# Altium schematic sheet УШЯИ687253.017Э3_2.SchDoc
size 420 x 297 mm; SheetNumber: 2; SheetTotal: 3
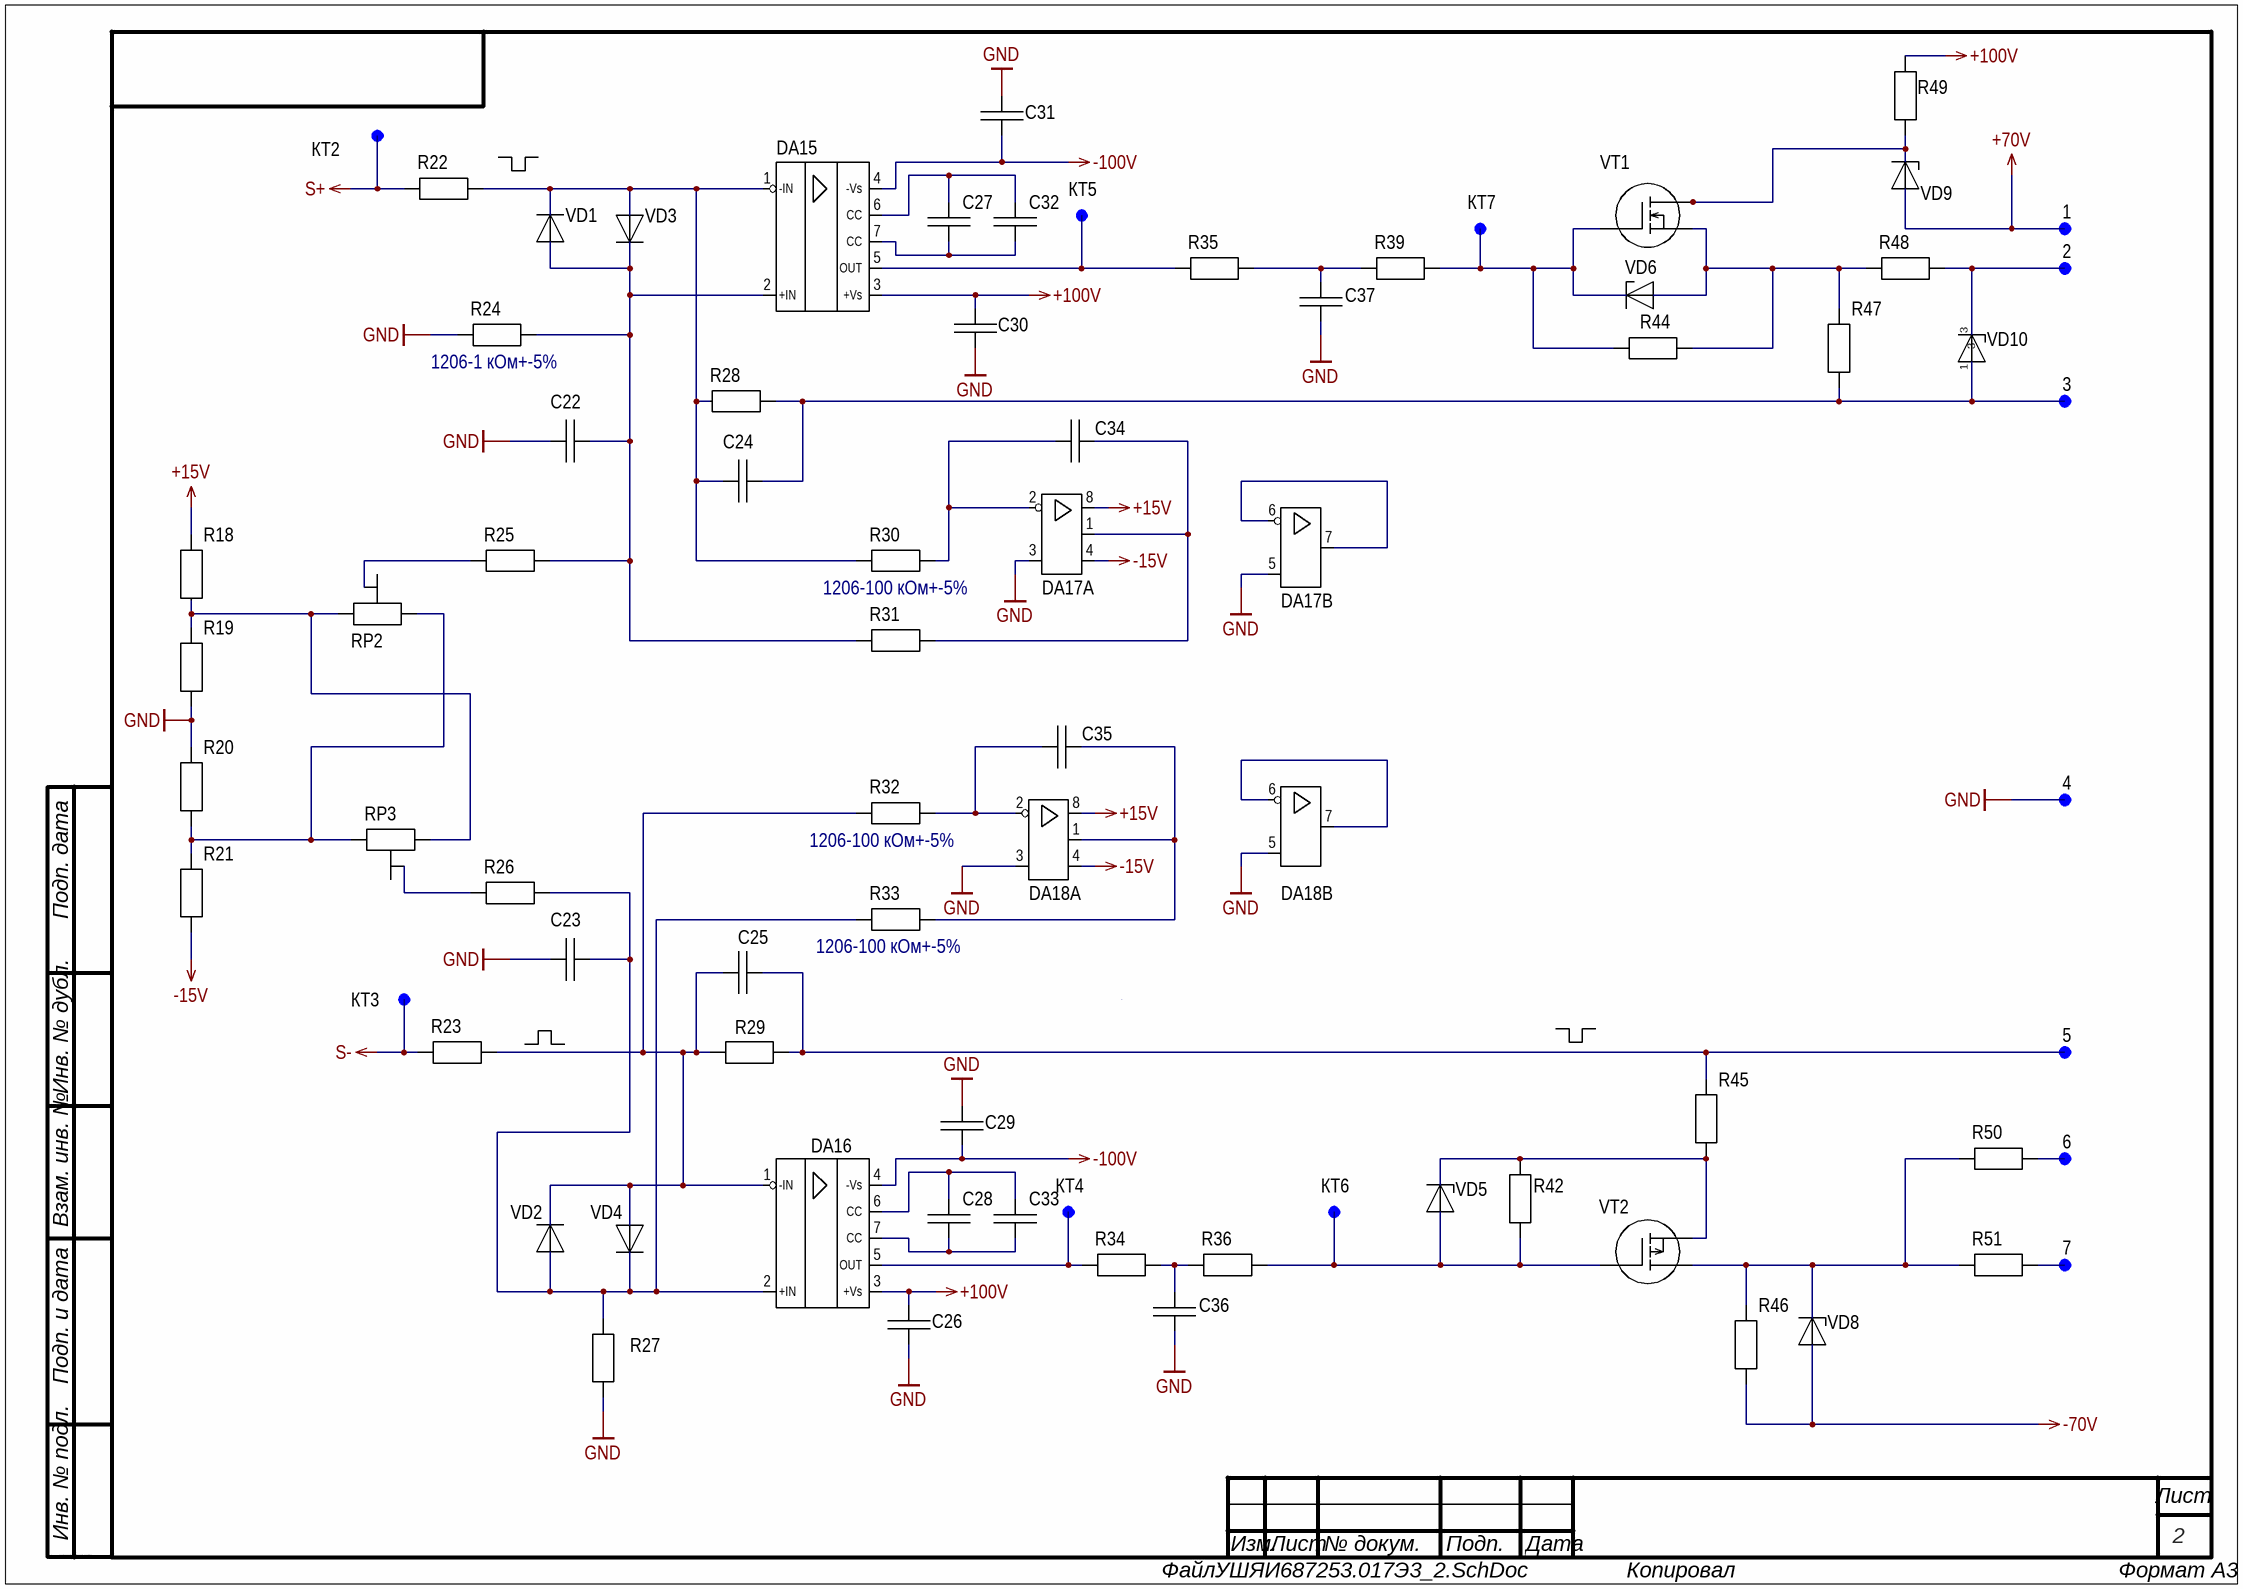
[diagram p0: УШЯИ687253.017Э3_2.SchDoc]

## Parts
1  OTV  (value not drawn)  (no BOM)
2  OTV  (value not drawn)  (no BOM)
3  OTV  (value not drawn)  (no BOM)
4  OTV  (value not drawn)  (no BOM)
5  OTV  (value not drawn)  (no BOM)
6  OTV  (value not drawn)  (no BOM)
7  OTV  (value not drawn)  (no BOM)
C22  1206-X7R-50 B-100 пФ+-10%  [CAP: 1206]  (value not drawn)
C23  1206-X7R-50 B-100 пФ+-10%  [CAP: 1206]  (value not drawn)
C24  0805-C0G-250 В-10 пФ +-5%  [CAP: 0805]  (value not drawn)
C25  0805-C0G-250 В-10 пФ +-5%  [CAP: 0805]  (value not drawn)
C26  2220-X7R-250 В-1 мкФ +-10%  [CAP: 2220]  (value not drawn)
C27  0805-C0G-250 В-10 пФ +-5%  [CAP: 0805]  (value not drawn)
C28  0805-C0G-250 В-10 пФ +-5%  [CAP: 0805]  (value not drawn)
C29  2220-X7R-250 В-1 мкФ +-10%  [CAP: 2220]  (value not drawn)
C30  2220-X7R-250 В-1 мкФ +-10%  [CAP: 2220]  (value not drawn)
C31  2220-X7R-250 В-1 мкФ +-10%  [CAP: 2220]  (value not drawn)
C32  0805-C0G-250 В-10 пФ +-5%  [CAP: 0805]  (value not drawn)
C33  0805-C0G-250 В-10 пФ +-5%  [CAP: 0805]  (value not drawn)
C34  0805-X7R-25 В-1 мкФ +-10%  [CAP: 0805]  (value not drawn)
C35  0805-X7R-25 В-1 мкФ +-10%  [CAP: 0805]  (value not drawn)
C36  220пФ NP0 1000В 5% 1206  [CAP: 1206]  (value not drawn)
C37  220пФ NP0 1000В 5% 1206  [CAP: 1206]  (value not drawn)
DA15  PA340CC  [7-DDPAC]  (value not drawn)
DA16  PA340CC  [7-DDPAC]  (value not drawn)
DA17  TLV9152IDR  [8-SOIC]  (value not drawn)  (parts A,B of 2)
DA18  TLV9152IDR  [8-SOIC]  (value not drawn)  (parts A,B of 2)
R18  1206-15 кОм+-5%  [1206]  (value not drawn)
R19  1206-51 Ом+-5%  [1206]  (value not drawn)
R20  1206-51 Ом+-5%  [1206]  (value not drawn)
R21  1206-51 кОм+-5%  [1206]  (value not drawn)
R22  1206-2 кОм+-0.5%  [1206]  (value not drawn)
R23  1206-2 кОм+-0.5%  [1206]  (value not drawn)
R24  1206-1 кОм+-5%  [1206]
R25  1206-20 кОм+-0.5%  [1206]  (value not drawn)
R26  1206-20 кОм+-0.5%  [1206]  (value not drawn)
R27  1206-75 кОм+-5%  [1206]  (value not drawn)
R28  1206-20 кОм+-0.5%  [1206]  (value not drawn)
R29  1206-20 кОм+-0.5%  [1206]  (value not drawn)
R30  1206-100 кОм+-5%  [1206]
R31  1206-100 кОм+-5%  [1206]  (value not drawn)
R32  1206-100 кОм+-5%  [1206]
R33  1206-100 кОм+-5%  [1206]
R34  1206-240 Ом+-5%  [1206]  (value not drawn)
R35  1206-1,2 кОм+-5%  [1206]  (value not drawn)
R36  1206-240 Ом+-5%  [1206]  (value not drawn)
R39  1206-1,2 кОм+-5%  [1206]  (value not drawn)
R42  1206-2,4 кОм+-5%  [1206]  (value not drawn)
R44  1206-2,4 кОм+-5%  [1206]  (value not drawn)
R45  1206-180 Ом+-5%  [1206]  (value not drawn)
R46  1206-100 Ом+-5%  [1206]  (value not drawn)
R47  1206-1 кОм+-5%  [1206]  (value not drawn)
R48  1206-51 Ом+-5%  [1206]  (value not drawn)
R49  1206-10 Ом+-5%  [1206]  (value not drawn)
R50  1206-10 Ом+-5%  [1206]  (value not drawn)
R51  1206-10 Ом+-5%  [1206]  (value not drawn)
RP2  3329H-1-102LF  [3329H]  (value not drawn)
RP3  3329H-1-102LF  [3329H]  (value not drawn)
VD1  1N4148WS  [SOD-323F]  (value not drawn)
VD2  1N4148WS  [SOD-323F]  (value not drawn)
VD3  1N4148WS  [SOD-323F]  (value not drawn)
VD4  1N4148WS  [SOD-323F]  (value not drawn)
VD5  BZX84C15LT1G  [SOT-23-3]  (value not drawn)
VD6  BZX84C15LT1G  [SOT-23-3]  (value not drawn)
VD8  BZX84C15LT1G  [SOT-23-3]  (value not drawn)
VD9  BZX84C6V2LT1G  [SOT-23-3]  (value not drawn)
VD10  BZX84C15LT1G  [SOT-23-3]  (value not drawn)
VT1  ZXMN10A08E6TA  [SOT-23-6]  (value not drawn)
VT2  ZXMP10A17E6TA  [SOT-23-6]  (value not drawn)
КТ2  Лепесток  [LEPESTOK7750224]  (value not drawn)
КТ3  Лепесток  [LEPESTOK7750224]  (value not drawn)
КТ4  Лепесток  [LEPESTOK7750224]  (value not drawn)
КТ5  Лепесток  [LEPESTOK7750224]  (value not drawn)
КТ6  Лепесток  [LEPESTOK7750224]  (value not drawn)
КТ7  Лепесток  [LEPESTOK7750224]  (value not drawn)

## Nets
+15V: DA17.8(Vs+) DA18.8(Vs+) R18.2
+70V: 1.?1 VD9.1
+100V: C26.2 C30.2 DA15.3(+Vs) DA16.3(+Vs) R49.1
-15V: DA17.4(Vs-) DA18.4(Vs-) R21.1
-70V: R46.1 VD8.1
-100V: C29.1 C31.1 DA15.4(-Vs) DA16.4(-Vs)
GND: 4.?1 C22.1 C23.1 C26.1 C29.2 C30.1 C31.2 C36.1 C37.1 DA17.3(+IN) DA17.5(+IN) DA18.3(+IN) DA18.5(+IN) R19.1 R20.2 R24.1 R27.1
S+: R22.1 КТ2.1
S-: R23.1 КТ3.1
Net2_?1: 2.?1 R48.2 VD10.3
Net3_?1: 3.?1 C24.2 R28.2 R47.1 VD10.1
Net5_?1: 5.?1 C25.2 R29.2 R45.2
Net6_?1: 6.?1 R50.2
Net7_?1: 7.?1 R51.2
NetC22_2: C22.2 DA15.2(+IN) R24.2 R25.2 R31.1 VD1.2 VD3.1
NetC23_2: C23.2 DA16.2(+IN) R26.2 R27.2 R33.1 VD2.2 VD4.1
NetC24_1: C24.1 DA15.1(-IN) R22.2 R28.1 R30.1 VD1.1 VD3.2
NetC25_1: C25.1 DA16.1(-IN) R23.2 R29.1 R32.1 VD2.1 VD4.2
NetC27_1: C27.1 C32.1 DA15.7(СС)
NetC27_2: C27.2 C32.2 DA15.6(СС)
NetC28_1: C28.1 C33.1 DA16.7(СС)
NetC28_2: C28.2 C33.2 DA16.6(СС)
NetC34_1: C34.1 DA17.1(OUT) R31.2
NetC34_2: C34.2 DA17.2(-IN) R30.2
NetC35_1: C35.1 DA18.1(OUT) R33.2
NetC35_2: C35.2 DA18.2(-IN) R32.2
NetC36_2: C36.2 R34.2 R36.1
NetC37_2: C37.2 R35.2 R39.1
NetDA15_5: DA15.5(OUT) R35.1 КТ5.1
NetDA16_5: DA16.5(OUT) R34.1 КТ4.1
NetDA17_6: DA17.6(-IN) DA17.7(OUT)
NetDA18_6: DA18.6(-IN) DA18.7(OUT)
NetR18_1: R18.1 R19.2 RP2.3(CW) RP3.3(CW)
NetR20_1: R20.1 R21.2 RP2.1(CCW) RP3.1(CCW)
NetR25_1: R25.1 RP2.2(WIPER)
NetR26_1: R26.1 RP3.2(WIPER)
NetR36_2: R36.2 R42.1 VD5.1 VT2.3(G) КТ6.1
NetR39_2: R39.2 R44.1 VD6.3 VT1.3(G) КТ7.1
NetR42_2: R42.2 R45.1 VD5.3 VT2.4(S)
NetR44_2: R44.2 R47.2 R48.1 VD6.1 VT1.4(S)
NetR46_2: R46.2 R50.1 R51.1 VD8.3 VT2.1,2,5,6(D)
NetR49_2: R49.2 VD9.3 VT1.1 VT1.2 VT1.5(D) VT1.6

## Notes on the sheet
- Подп. дата
- Инв. № дубл.
- Взам. инв. №
- Подп. и дата
- Инв. № подл.
- Изм.
- Лист
- № докум.
- Подп.
- Дата
- ALTIUM GOSTBOM2.0 KEV
- Файл:
- Копировал
- Формат А3

## Library data of the parts
1-7 = OTV: System: Connector
C22 C23 = 1206-X7R-50 B-100 пФ+-10%: Value: 100 пФ
C24 C25 C27 C28 C32 C33 = 0805-C0G-250 В-10 пФ +-5%: Value: 10 пФ
C26 C29-C31 = 2220-X7R-250 В-1 мкФ +-10%: Value: 1 мкФ
C34 C35 = 0805-X7R-25 В-1 мкФ +-10%: Value: 1 мкФ
DA15 DA16 = PA340CC: High Voltage Power Operational Amplifier
R18 = 1206-15 кОм+-5%: Value: 15 кОм; ModelPrint: 1206
R19 R20 R48 = 1206-51 Ом+-5%: Value: 51 Ом; ModelPrint: 1206
R21 = 1206-51 кОм+-5%: Value: 51 кОм; ModelPrint: 1206
R22 R23 = 1206-2 кОм+-0.5%: Value: 2 кОм; ModelPrint: 1206
R24 R47 = 1206-1 кОм+-5%: Value: 1 кОм; ModelPrint: 1206
R25 R26 R28 R29 = 1206-20 кОм+-0.5%: Value: 20 кОм; ModelPrint: 1206
R27 = 1206-75 кОм+-5%: Value: 75 кОм; ModelPrint: 1206
R30-R33 = 1206-100 кОм+-5%: Value: 100 кОм; ModelPrint: 1206
R34 R36 = 1206-240 Ом+-5%: Value: 240 Ом; ModelPrint: 1206
R35 R39 = 1206-1,2 кОм+-5%: Value: 1,2 кОм; ModelPrint: 1206
R42 R44 = 1206-2,4 кОм+-5%: Value: 2,4 кОм; ModelPrint: 1206
R45 = 1206-180 Ом+-5%: Value: 180 Ом; ModelPrint: 1206
R46 = 1206-100 Ом+-5%: Value: 100 Ом; ModelPrint: 1206
R49-R51 = 1206-10 Ом+-5%: Value: 10 Ом; ModelPrint: 1206
RP2 RP3 = 3329H-1-102LF: Variable Resistor 1kOm
VD1-VD4 = 1N4148WS: Small Signal Fast Switching Diod; Value: *
VT1 = ZXMN10A08E6TA: MOSFET, N, SOT-23-6; Transistor Type: MOSFET; Transistor Polarity: N; Voltage, Vds Typ: 100V; Current, Id Cont: 1.5A;
VT2 = ZXMP10A17E6TA: P-Channel 100 V 0.35 Ohm Power MOSFET Surface Mount - SOT-23-6
КТ2-КТ7 = Lepestok
C36 C37 = 220пФ NP0 1000В 5% 1206: Value: 220пФ